# EAGLE design Project_design_v1.0 (EAGLE 8.4.0)
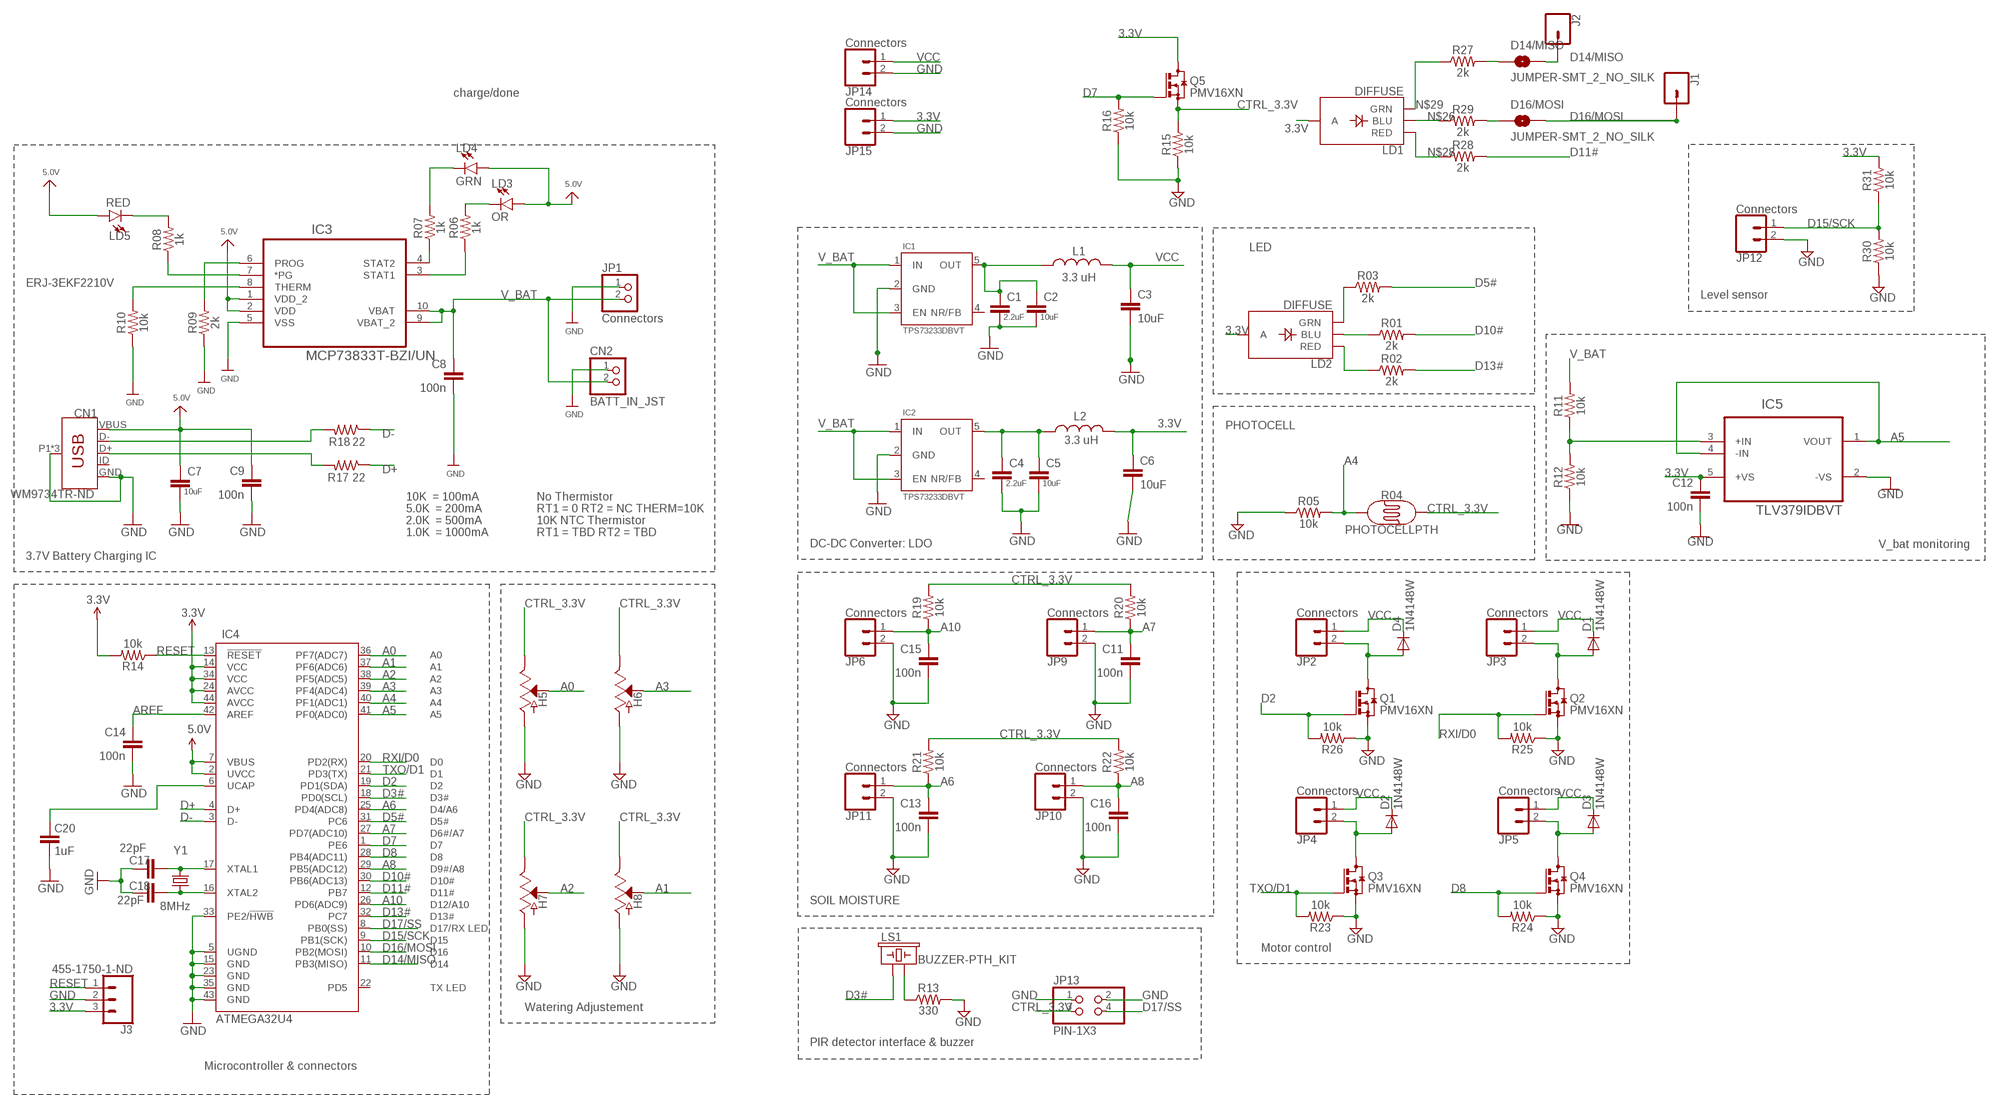
[diagram p0: schematic, sheet 1]

## Parts
C1  2.2uF  CAP0603-CAP  [0603-CAP]
C2  10uF  CAP0603-CAP  [0603-CAP]
C3  10uF  CAP0603-CAP  [0603-CAP]
C4  2.2uF  CAP0603-CAP  [0603-CAP]
C5  10uF  CAP0603-CAP  [0603-CAP]
C6  10uF  CAP0603-CAP  [0603-CAP]
C7  10uF  CAP0603-CAP  [0603-CAP]
C8  100n  CAPA0402  [0402]
C9  100n  CAPA0402  [0402]
C11  100n  CAPA0402  [0402]
C12  100n  CAPA0402  [0402]
C13  100n  CAPA0402  [0402]
C14  100n  CAPA0402  [0402]
C15  100n  CAPA0402  [0402]
C16  100n  CAPA0402  [0402]
C17  22pF  CAP0603-CAP  [0603-CAP]
C18  22pF  CAP0603-CAP  [0603-CAP]
C20  1uF  CAP0603-CAP  [0603-CAP]
CN1  WM9734TR-ND  USB_MICRO-B_FEMALE-SMT-VERT  [USB-B-MICRO-SMD_VERT]
CN2  BATT_IN_JST  JST_2PIN  [JSTPH2]
D1  1N4148W  CGRM4002-G  [SOD-123_MINI-SMA]
D2  1N4148W  CGRM4002-G  [SOD-123_MINI-SMA]
D3  1N4148W  CGRM4002-G  [SOD-123_MINI-SMA]
D4  1N4148W  CGRM4002-G  [SOD-123_MINI-SMA]
D14/MISO  JUMPER-SMT_2_NO_SILK  [SMT-JUMPER_2_NO_SILK]
D16/MOSI  JUMPER-SMT_2_NO_SILK  [SMT-JUMPER_2_NO_SILK]
H5  POT1  SOIL_MOISTURE  [SOIL_MOISTURE]
H6  POT2  SOIL_MOISTURE  [SOIL_MOISTURE]
H7  POT3  SOIL_MOISTURE  [SOIL_MOISTURE]
H8  POT4  SOIL_MOISTURE  [SOIL_MOISTURE]
IC1  TPS73233DBVT  TPS732XXDBV  [SOT23-5]
IC2  TPS73233DBVT  TPS732XXDBV  [SOT23-5]
IC3  MCP73833T-BZI/UN  [SOP50P490X110-10N]
IC4  ATMEGA32U4  ATMEGA32U4TQFP-44  [TQFP44]
IC5  TLV379IDBVT  AD8009JRTZ-REEL  [SOT95P280X145-5N]
J1  CONN_01  [1X01]
J2  CONN_01  [1X01]
J3  455-1750-1-ND  CONN_03  [1X03]
JP1  Connectors  PINHD-1X2  [1X02]
JP2  Connectors  CONN_02  [1X02]
JP3  Connectors  CONN_02  [1X02]
JP4  Connectors  CONN_02  [1X02]
JP5  Connectors  CONN_02  [1X02]
JP6  Connectors  CONN_02  [1X02]
JP9  Connectors  CONN_02  [1X02]
JP10  Connectors  CONN_02  [1X02]
JP11  Connectors  CONN_02  [1X02]
JP12  Connectors  CONN_02  [1X02]
JP13  PIN-1X3  PINHD-2X2  [2X02]
JP14  Connectors  CONN_02  [1X02]
JP15  Connectors  CONN_02  [1X02]
L1  3.3 uH  INDUCTOR0603  [0603]
L2  3.3 uH  INDUCTOR0603  [0603]
LD1  DIFFUSE  LED_RGB_THRU_CA  [LED-RGB_THRU_5MM]
LD2  DIFFUSE  LED_RGB_THRU_CA  [LED-RGB_THRU_5MM]
LD3  OR  LED3MM  [LED_3MM]
LD4  GRN  LED3MM  [LED_3MM]
LD5  RED  LED3MM  [LED_3MM]
LS1  BUZZER-PTH_KIT  [BUZZER-12MM-KIT]
Q1  PMV16XN  [SOT23]
Q2  PMV16XN  [SOT23]
Q3  PMV16XN  [SOT23]
Q4  PMV16XN  [SOT23]
Q5  PMV16XN  [SOT23]
R01  2k  0603RESIST  [0603]
R02  2k  0603RESIST  [0603]
R03  2k  0603RESIST  [0603]
R04  PHOTOCELLPTH  [PHOTOCELL]
R05  10k  0603RESIST  [0603]
R06  1k  0603RESIST  [0603]
R07  1k  0603RESIST  [0603]
R08  1k  0603RESIST  [0603]
R09  2k  0603RESIST  [0603]
R10  10k  0603RESIST  [0603]
R11  10k  0603RESIST  [0603]
R12  10k  0603RESIST  [0603]
R13  330  0603RESIST  [0603]
R14  10k  0603RESIST  [0603]
R15  10k  0603RESIST  [0603]
R16  10k  0603RESIST  [0603]
R17  22  RESISTOR0603-RES  [0603-RES]
R18  22  RESISTOR0603-RES  [0603-RES]
R19  10k  0603RESIST  [0603]
R20  10k  0603RESIST  [0603]
R21  10k  0603RESIST  [0603]
R22  10k  0603RESIST  [0603]
R23  10k  0603RESIST  [0603]
R24  10k  0603RESIST  [0603]
R25  10k  0603RESIST  [0603]
R26  10k  0603RESIST  [0603]
R27  2k  0603RESIST  [0603]
R28  2k  0603RESIST  [0603]
R29  2k  0603RESIST  [0603]
R30  10k  0603RESIST  [0603]
R31  10k  0603RESIST  [0603]
Y1  8MHz  CRYSTAL5X3  [CRYSTAL-SMD-5X3]

## Nets
3.3V: C6.1 C12.1 IC4.14(VCC) IC4.24(AVCC) IC4.34(VCC) IC4.44(AVCC) IC5.5(+VS) J3.3 JP15.1 L2.2 LD1.3(A) LD2.3(A) Q5.3(D) R14.2 R31.2
5.0V: C7.1 C9.1 CN1.VBUS IC3.1(VDD_2) IC3.2(VDD) IC4.2(UVCC) IC4.7(VBUS) LD3.A LD4.A LD5.A
A0: H5.3(VOUT) IC4.36(PF7(ADC7))
A1: H8.3(VOUT) IC4.37(PF6(ADC6))
A2: H7.3(VOUT) IC4.38(PF5(ADC5))
A3: H6.3(VOUT) IC4.39(PF4(ADC4))
A4: IC4.40(PF1(ADC1)) R04.1 R05.2
A5: IC4.41(PF0(ADC0)) IC5.1(VOUT) IC5.4(-IN)
A6: C13.1 IC4.25(PD4(ADC8)) JP11.1 R21.1
A7: C11.1 IC4.27(PD7(ADC10)) JP9.1 R20.1
A8: C16.1 IC4.29(PB5(ADC12)) JP10.1 R22.1
A10: C15.1 IC4.26(PD6(ADC9)) JP6.1 R19.1
AREF: C14.1 IC4.42(AREF)
CTRL_3.3V: H5.1(VCC) H6.1(VCC) H7.1(VCC) H8.1(VCC) JP13.3 Q5.2(S) R04.2 R15.2 R19.2 R20.2 R21.2 R22.2
D2: IC4.19(PD1(SDA)) Q1.1(G) R26.2
D3#: IC4.18(PD0(SCL)) LS1.+
D5#: IC4.31(PC6) R03.2
D7: IC4.1(PE6) Q5.1(G) R16.2
D8: IC4.28(PB4(ADC11)) Q4.1(G) R24.2
D10#: IC4.30(PB6(ADC13)) R01.2
D11#: IC4.12(PB7) R28.2
D13#: IC4.32(PC7) R02.2
D14/MISO: D14/MISO.2 IC4.11(PB3(MISO)) J2.1
D15/SCK: IC4.9(PB1(SCK)) JP12.1 R30.2 R31.1
D16/MOSI: D16/MOSI.2 IC4.10(PB2(MOSI)) J1.1
D17/SS: IC4.8(PB0(SS)) JP13.4
D+: IC4.4(D+) R17.1
D-: IC4.3(D-) R18.1
GND: C1.2 C2.2 C3.2 C4.2 C5.2 C6.2 C7.2 C8.2 C9.2 C11.2 C12.2 C13.2 C14.2 C15.2 C16.2 C17.2 C18.2 C20.1 CN1.GND CN1.P1(SHIELD) CN1.P2(SHIELD) CN1.P3(SHIELD) CN2.1 H5.2(GND) H6.2(GND) H7.2(GND) H8.2(GND) IC1.2(GND) IC2.2(GND) IC3.5(VSS) IC4.5(UGND) IC4.15(GND) IC4.23(GND) IC4.33(PE2/!HWB) IC4.35(GND) IC4.43(GND) IC5.2(-VS) J3.2 JP1.1 JP6.2 JP9.2 JP10.2 JP11.2 JP12.2 JP13.1 JP13.2 JP14.2 JP15.2 Q1.2(S) Q2.2(S) Q3.2(S) Q4.2(S) R05.1 R09.1 R10.1 R12.1 R13.2 R15.1 R16.1 R23.1 R24.1 R25.1 R26.1 R30.1
N$1: LD2.2(GRN) R03.1
N$2: C4.1 C5.1 IC2.5(OUT) L2.1
N$3: LD3.K(C) R06.2
N$4: LD4.K(C) R07.2
N$5: IC3.4(STAT2) R07.1
N$6: IC3.3(STAT1) R06.1
N$7: IC3.7(*PG) R08.1
N$8: IC3.8(THERM) R10.2
N$9: C18.1 IC4.16(XTAL2) Y1.1
N$10: D4.A JP2.2 Q1.3(D)
N$11: D1.A JP3.2 Q2.3(D)
N$12: LD5.K(C) R08.2
N$13: C1.1 C2.1 IC1.5(OUT) L1.1
N$14: D2.A JP4.2 Q3.3(D)
N$15: D3.A JP5.2 Q4.3(D)
N$16: IC3.6(PROG) R09.2
N$17: IC5.3(+IN) R11.1 R12.2
N$18: C17.1 IC4.17(XTAL1) Y1.3
N$19: C20.2 IC4.6(UCAP)
N$20: CN1.D- R18.2
N$21: CN1.D+ R17.2
N$22: LS1.- R13.1
N$26: LD1.1(BLU) R29.1
N$28: LD1.4(RED) R28.1
N$29: LD1.2(GRN) R27.1
N$30: D16/MOSI.1 R29.2
N$32: D14/MISO.1 R27.2
N$34: LD2.1(BLU) R01.1
N$35: LD2.4(RED) R02.1
RESET: IC4.13(!RESET) J3.1 R14.1
RXI/D0: IC4.20(PD2(RX)) Q2.1(G) R25.2
TXO/D1: IC4.21(PD3(TX)) Q3.1(G) R23.2
V_BAT: C8.1 CN2.2 IC1.1(IN) IC1.3(EN) IC2.1(IN) IC2.3(EN) IC3.9(VBAT_2) IC3.10(VBAT) JP1.2 R11.2
VCC: C3.1 D1.C D2.C D3.C D4.C JP2.1 JP3.1 JP4.1 JP5.1 JP14.1 L1.2
Unconnected: CN1.ID IC1.4(NR/FB) IC2.4(NR/FB) IC4.22(PD5)

## Notes on the sheet
- charge/done
- LED
- ERJ-3EKF2210V
- Level sensor
- PHOTOCELL
- 10K  = 100mA | No Thermistor
- 5.0K  = 200mA | RT1 = 0 RT2 = NC THERM=10K
- 2.0K  = 500mA | 10K NTC Thermistor
- 1.0K  = 1000mA | RT1 = TBD RT2 = TBD
- DC-DC Converter: LDO | V_bat monitoring
- 3.7V Battery Charging IC
- SOIL MOISTURE
- Motor control
- Watering Adjustement
- PIR detector interface & buzzer
- Microcontroller & connectors

## Library data of the parts
C1 C4 = SparkFun-Passives:CAP: Capacitor Standard 0603 ceramic capacitor, and 0.1" leaded capacitor.; PARTNO: C1608X7S1C225K080AC
C2 C3 C5-C7 = SparkFun-Passives:CAP: Capacitor Standard 0603 ceramic capacitor, and 0.1" leaded capacitor.; PARTNO: GRM188R60J106ME47D
C8 C9 C11-C16 = custom_part:CAPA; PARTNO: CGA2B3X7R1E104K050BB
C17 C18 = SparkFun:CAP: Capacitor Standard 0603 ceramic capacitor, and 0.1" leaded capacitor.; PARTNO: CL10C2R2BB8NNNC
C20 = SparkFun:CAP: Capacitor Standard 0603 ceramic capacitor, and 0.1" leaded capacitor.; PARTNO: CL10B105KP8NNNC
CN1 = SparkFun-Connectors:USB_MICRO-B: USB Type Micro-B Connector Male/female and PTH/SMT variants SparkFun Products: SparkFun microB USB Breakout <https://www.sparkfun.com/products/12035> SparkFun USB microB Plug Breakout <https://www.sparkfun.com/products/10031> SparkFun ESP8266 Thing <https://www.sparkfun.com/products/13231>; PARTNO: 1051330011; PROD_ID: CONN-13534
CN2 = microbuilder:JST_2PIN: JST 2-Pin Right-Angle Connector PH-Series - 4UConnector: 17311 SH-Series - 4UConnector: 07278; PARTNO: B2B-XH-A(LF)(SN)
D1-D4 = diode:CGRM400*-G: Molded plasitc,JEDEC SOD-123/Mini SMA Source: Comchip CGRM4001-G.pdf; PARTNO: 1N4148W
D14/MISO D16/MOSI = SparkFun-Jumpers:JUMPER-SMT_2_NO: Normally open jumper This jumper has two pads in close proximity to each other. Apply solder to close the connection. Round pads are easier to solder for beginners, but are a lot larger. SparkFun Product that uses the round pads: SparkFun EL Sequencer <https://www.sparkfun.com/products/12781>
H5-H8 = potentiometer:SOIL_MOISTURE; PARTNO: SEN-13322
IC1 IC2 = TPS32xx:TPS732XX: Cap-Free, NMOS, 250mA Low Dropout Regulator with Reverse Current Protection; PARTNO: TPS73233DBVT
IC3 = MCP73833T-BZI_UN:MCP73833T-BZI/UN: LI-ION/LI-POLY CONTROLLERS; AVAILABILITY: Good; DESCRIPTION: Linear Charge Management Controller Li-Ion/Li-Pol 1mA 4.2V/4.35V/4.4V/4.5V 10-Pin MSOP T/R; MF: Microchip; MP: MCP73833T-BZI/UN; PACKAGE: MSOP-10 Microchip; PRICE: 0.72 USD
IC4 = ATMEGA32U4:ATMEGA32U4: Atmel 44-pin 8-bit Microcontroller with 32KBytes of ISP Flash and USB Controller; AVAILABILITY: Good; DESCRIPTION: Embedded microcontroller ATMEGA32U4RC-AU TQFP 44 (10x10) Microchip Technology 8-Bit 16 MHz I/O number 26; MF: Microchip; MP: ATMEGA32U4RC-AU; PACKAGE: TQFP-44 Microchip; PARTNO: ATMEGA32U4RC-MUR; PRICE: 3.89 USD
IC5 = AD8009JRTZ-REEL:AD8009JRTZ-REEL: Low Distortion Amplifier; AVAILABILITY: Unavailable; DESCRIPTION: Ic Opamp Cfa 845mhz Sot23-5; MF: Analog Devices; MP: AD8009JRTZ-REEL; PACKAGE: SOT-23-5 Analog Devices; PARTNO: TLV379IDBVT; PRICE: 1.92 USD
J1 J2 = SparkFun-Connectors:CONN_01: Single connection point. Often used as Generic Header-pin footprint for 0.1 inch spaced/style header connections On any of the 0.1 inch spaced packages, you can populate with these: Break Away Headers - Straight <https://www.sparkfun.com/products/116> (PRT-00116) Break Away Male Headers - Right Angle <https://www.sparkfun.com/products/553> (PRT-00553) Female Headers <https://www.sparkfun.com/products/115> (PRT-00115) Break Away Headers - Machine Pin <https://www.sparkfun.com/products/117> (PRT-00117) Break Away Female Headers - Swiss Machine Pin <https://www.sparkfun.com/products/743> (PRT-00743) This device is also useful as a general connection point to wire up your design to another part of your project. Our various solder wires solder well into these plated through hole pads. Hook-Up Wire - Assortment (Stranded, 22 AWG) <https://www.sparkfun.com/products/11375> (PRT-11375) Hook-Up Wire - Assortment (Solid Core, 22 AWG) <https://www.sparkfun.com/products/11367> (PRT-11367) View the entire wire category on our website here <https://www.sparkfun.com/categories/141> Special notes: SMTSO-256-ET is a "flush mount" nut for a 4-40 screw. We mostly use this on specialty testbeds; it is a nice way to connect hardware to your PCB at an adjustable hieght. Also note, the SNAP packages are for using a snappable style connector. We sell a baggie of snaps and they are also used on two LilyPad designs: Snap Assortment - 30 pack (male and female) <https://www.sparkfun.com/products/11347> (DEV-11347) LilyPad Arduino SimpleSnap <https://www.sparkfun.com/products/10941> (DEV-10941) LilyPad SimpleSnap Protoboard <https://www.sparkfun.com/products/10940> (DEV-10940)
J3 = SparkFun-Connectors:CONN_03: Multi connection point. Often used as Generic Header-pin footprint for 0.1 inch spaced/style header connections On any of the 0.1 inch spaced packages, you can populate with these: Break Away Headers - Straight <https://www.sparkfun.com/products/116> (PRT-00116) Break Away Male Headers - Right Angle <https://www.sparkfun.com/products/553> (PRT-00553) Female Headers <https://www.sparkfun.com/products/115> (PRT-00115) Break Away Headers - Machine Pin <https://www.sparkfun.com/products/117> (PRT-00117) Break Away Female Headers - Swiss Machine Pin <https://www.sparkfun.com/products/743> (PRT-00743) Stackable Header - 3 Pin (Female, 0.1") <https://www.sparkfun.com/products/13875> (PRT-13875) For SCREWTERMINALS and SPRING TERMINALS visit here: Screw Terimnals on SparkFun.com <https://www.sparkfun.com/search/results?term=Screw+Terminals> (5mm/3.5mm/2.54mm spacing) This device is also useful as a general connection point to wire up your design to another part of your project. Our various solder wires solder well into these plated through hole pads. Hook-Up Wire - Assortment (Stranded, 22 AWG) <https://www.sparkfun.com/products/11375> (PRT-11375) Hook-Up Wire - Assortment (Solid Core, 22 AWG) <https://www.sparkfun.com/products/11367> (PRT-11367) View the entire wire category on our website here <https://www.sparkfun.com/categories/141> Special notes: Molex polarized connector foot print use with SKU : PRT-08232 with associated crimp pins and housings.; PROD_ID: XXX-00000
JP1 = pinhead:PINHD-1X2: PIN HEADER; PARTNO: /
JP2-JP6 JP9-JP12 JP14 JP15 = SparkFun-Connectors:CONN_02: Multi connection point. Often used as Generic Header-pin footprint for 0.1 inch spaced/style header connections On any of the 0.1 inch spaced packages, you can populate with these: Break Away Headers - Straight <https://www.sparkfun.com/products/116> (PRT-00116) Break Away Male Headers - Right Angle <https://www.sparkfun.com/products/553> (PRT-00553) Female Headers <https://www.sparkfun.com/products/115> (PRT-00115) Break Away Headers - Machine Pin <https://www.sparkfun.com/products/117> (PRT-00117) Break Away Female Headers - Swiss Machine Pin <https://www.sparkfun.com/products/743> (PRT-00743) For SCREWTERMINALS and SPRING TERMINALS visit here: Screw Terimnals on SparkFun.com <https://www.sparkfun.com/search/results?term=Screw+Terminals> (5mm/3.5mm/2.54mm spacing) This device is also useful as a general connection point to wire up your design to another part of your project. Our various solder wires solder well into these plated through hole pads. Hook-Up Wire - Assortment (Stranded, 22 AWG) <https://www.sparkfun.com/products/11375> (PRT-11375) Hook-Up Wire - Assortment (Solid Core, 22 AWG) <https://www.sparkfun.com/products/11367> (PRT-11367) View the entire wire category on our website here <https://www.sparkfun.com/categories/141> Special notes: Molex polarized connector foot print use with: PRT-08233 with associated crimp pins and housings. 2.54_SCREWTERM for use with PRT-10571. 3.5mm Screw Terminal footprints for PRT-08084 5mm Screw Terminal footprints for use with PRT-08432; PARTNO: M20-9960245
JP13 = pinhead:PINHD-2X2: PIN HEADER; PARTNO: M22-2040805
L1 L2 = SparkFun-Passives:INDUCTOR: Inductors Basic Inductor/Choke - 0603 and 1206. Footprints are not proven and vary greatly between part numbers. SRN6045- 33uH, 20% 1.4A; PARTNO: LQM18PN3R3MGHD
LD1 LD2 = RGB_LED:LED_RGB_THRU_CA; PARTNO: WP154A4SEJ3VBDZGW/CA
LD3 = SparkFun-LED:LED: LED (Generic) Standard schematic elements and footprints for 5mm, 3mm, 1206, and 0603 sized LEDs. Generic LEDs with no color specified.; PARTNO: TLHO4600; PROD_ID: DIO-08794
LD4 = SparkFun-LED:LED: LED (Generic) Standard schematic elements and footprints for 5mm, 3mm, 1206, and 0603 sized LEDs. Generic LEDs with no color specified.; PARTNO: TLLG4400; PROD_ID: DIO-08794
LD5 = SparkFun-LED:LED: LED (Generic) Standard schematic elements and footprints for 5mm, 3mm, 1206, and 0603 sized LEDs. Generic LEDs with no color specified.; PARTNO: TLHK4600; PROD_ID: DIO-08794
LS1 = SparkFun-Electromechanical:BUZZER: Buzzer Small round buzzers that operate around the audible 2kHz range. You can use these as speakers to create simple music or user interfaces. Variant Overview: PTH - Mini Speaker - PC Mount 12mm 2.048kHz <https://www.sparkfun.com/products/7950> PTH_KIT - Mini Speaker - PC Mount 12mm 2.048kHz <https://www.sparkfun.com/products/7950> KIT simplifies soldering by adding stop mask to one side of the pads. PTH_NO_SILK - Mini Speaker - PC Mount 12mm 2.048kHz <https://www.sparkfun.com/products/7950> No silkscreen indicator of buzzer outline. PTH_KIT_NO_SILK - Mini Speaker - PC Mount 12mm 2.048kHz <https://www.sparkfun.com/products/7950> KIT package w/o silkscreen SMD - Buzzer Audio Magnetic (CCV-084B16) SMD buzzer used on, e.g. the LilyPad Buzzer <https://www.sparkfun.com/products/8463> and RFID USB Reader <https://www.sparkfun.com/products/9963>. SMD_KIT - Buzzer Audio Magnetic (CCV-084B16) SMD Buzzer with elongated pins to make soldering easier. Used on the SparkFun Simon Says - Surface Mount Soldering Kit <https://www.sparkfun.com/products/10935>.; PARTNO: CEM-1203(42); PROD_ID: COMP-08253; SF_SKU: COM-07950
Q1-Q5 = custom_part_2:PMV16XN; PARTNO: PMV16XNR
R01-R03 R09 R27-R29 = custom_part:0603RESIST; PARTNO: ERJ-PA3F2001V
R04 = SparkFun-Sensors:PHOTOCELL: Photocell (Photodetector, Photo Resistor, CdS) This is a very small light sensor. A photocell changes (also called a photodetector, photo resistor, CdS or photoconductive cell) resistance depending on the amount of light it is exposed to. These little sensors make great ambient light triggers (when light in the room turns on, do something). Datasheet <http://cdn.sparkfun.com/datasheets/Sensors/LightImaging/SEN-09088.pdf> SparkFun Products Mini Photocell <https://www.sparkfun.com/products/9088> (SEN-09088); PARTNO: 1528-2141-ND; PROD_ID: COMP-09129; SF_ID: SEN-09088
R05 R10-R12 R14-R16 R19-R26 R30 R31 = custom_part:0603RESIST; PARTNO: ERA-3AEB103V
R06-R08 R13 = custom_part:0603RESIST; PARTNO: RC0603JR-07330RL
R17 R18 = SparkFun:RESISTOR: Resistor Basic schematic elements and footprints for 0603, 1206, and PTH resistors.; PARTNO: RC0603JR-0722RL
Y1 = SparkFun:CRYSTAL: Crystals Various standard crystals. Proven footprints. Spark Fun Electronics SKU : COM-00534; PARTNO: ABM3C-8.000MHZ-D4Y-T

## Net classes
7 GND: width 0.152 mm, clearance 0.2 mm

## Board
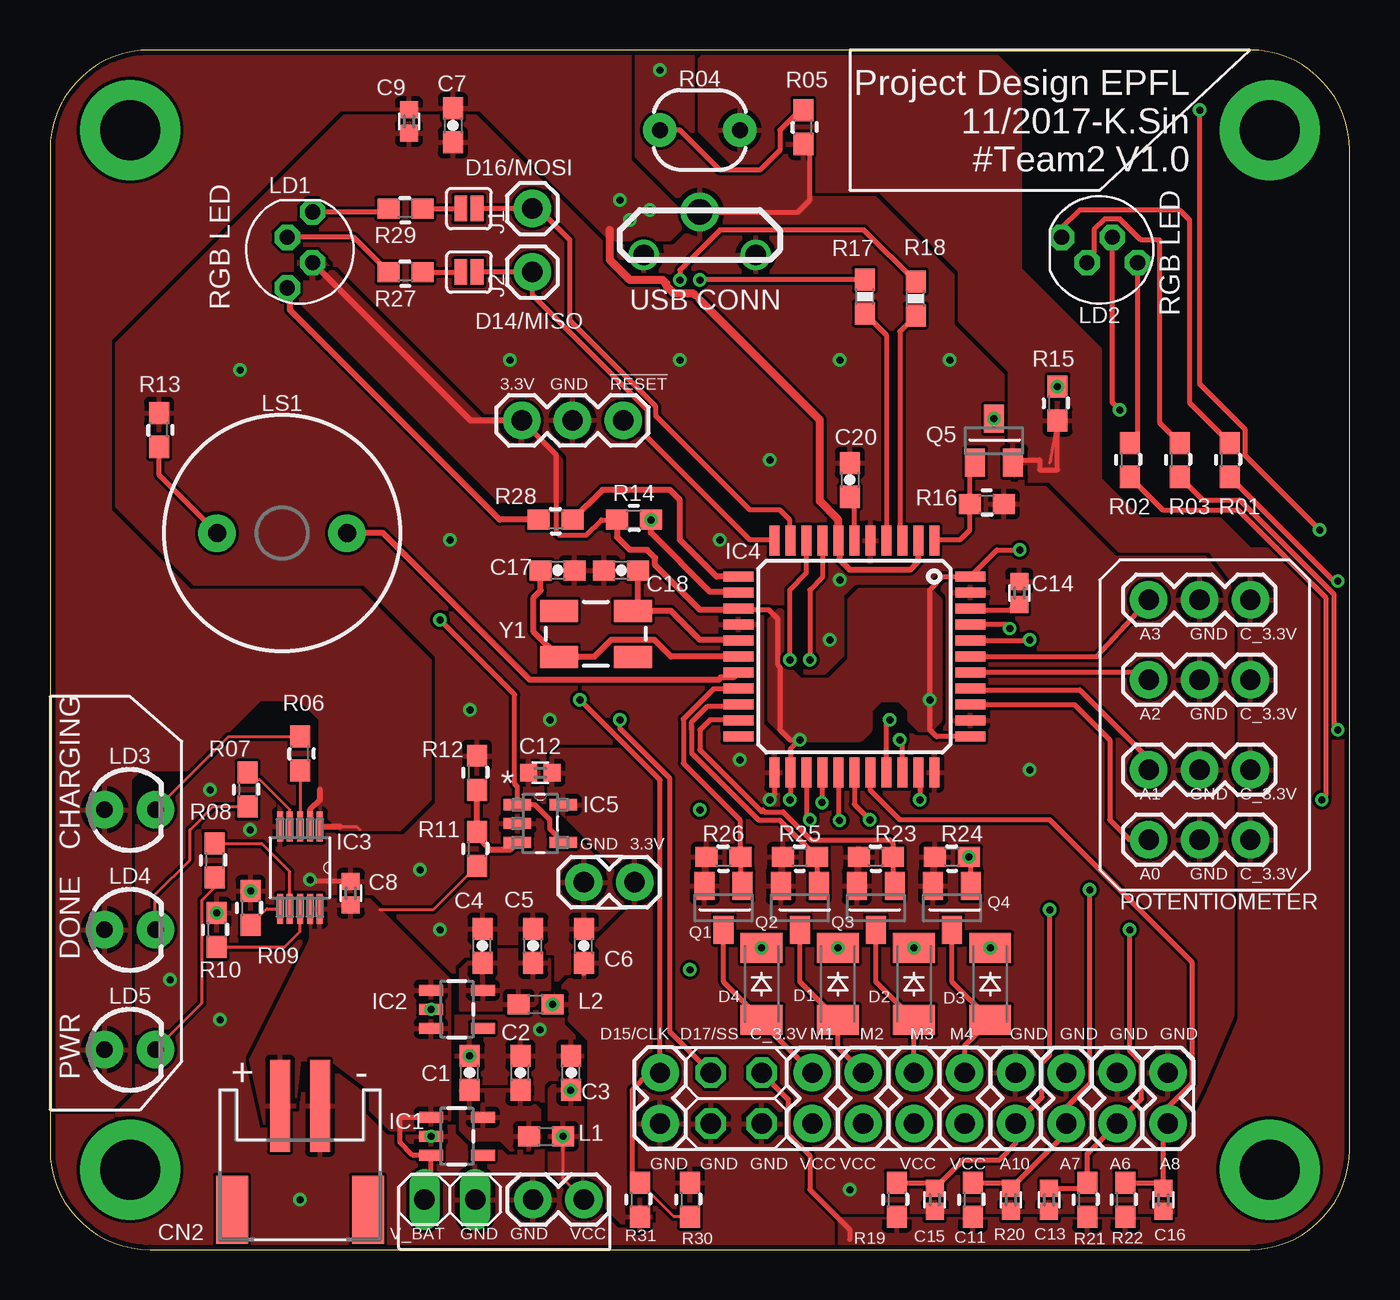
[diagram p1: board, top side]
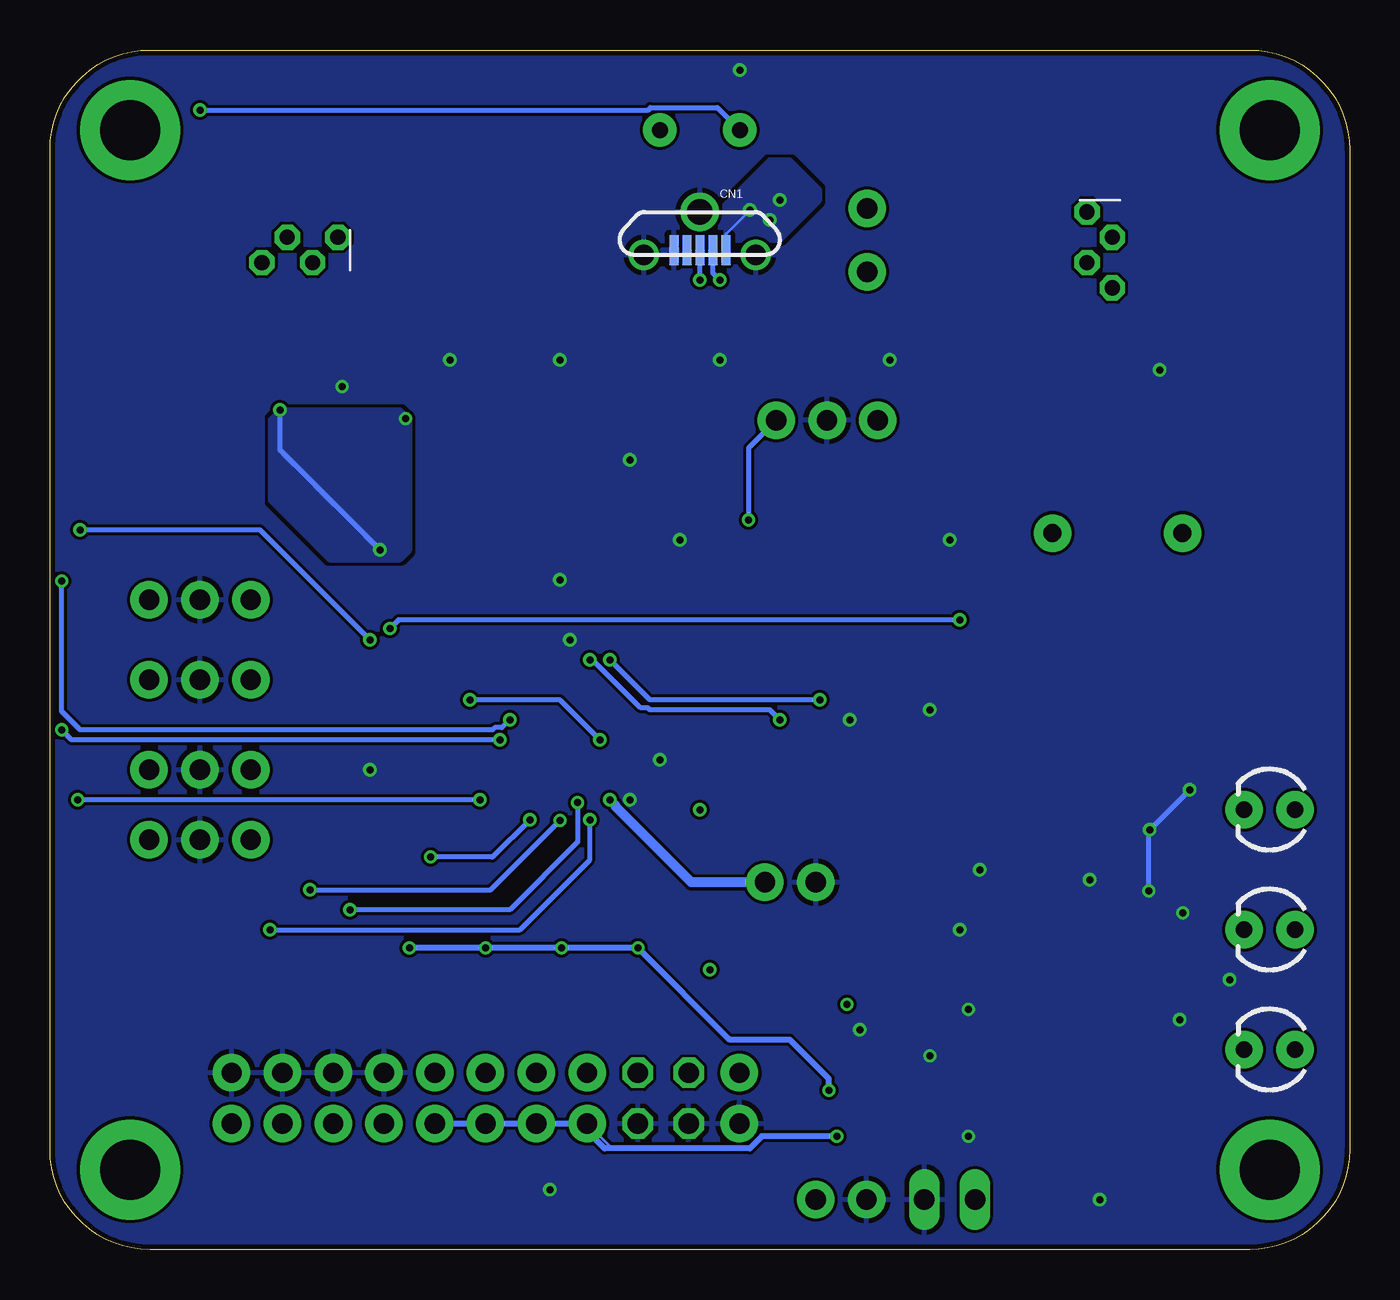
[diagram p2: board, bottom side, seen from below]

Size 65 x 60 mm. Coordinates in mm from the lower left corner, seen from the top.
Outline: 0,55 0,5 arc90 5,0 60,0 arc90 65,5 65,55 arc90 60,60 5,60 arc90 0,55
Copper layers (1*16): Top 0.035mm / dielectric 1.5mm / Bottom 0.035mm
Design rules "SeeedStudio_2layer_DRU_no_angle_20140221": minimum track width 6mil, minimum drill 12mil, track to track 6mil, track to pad 6mil, pad to pad 6mil, via to via 6mil, smd to smd 0mil, copper to edge 10mil, drill to drill 10mil, minimum pad ring 10mil, minimum via ring 6mil, stop-mask expansion 2mil, vias tented up to drill 100mil, thermal gap 10mil

### Footprints (pad centres in the part's own frame; a part is rotated, then mirrored left to right if it is on the bottom)
0603-CAP = smd 1.1 x 1: 1 -0.85,0; 2 0.85,0
0402 = smd 0.85 x 0.9: 1 -0.58,0; 2 0.58,0
USB-B-MICRO-SMD_VERT = smd 0.45 x 1.5: D+ 0,0; D- -0.65,0; GND 1.3,0; ID 0.65,0; VBUS -1.3,0 | drill 1.016: P1 -2.8,0.25; P2 2.8,0.25 | drill 1.27: P3 0,-1.9
JSTPH2 = smd 1 x 4.6: 1 -1,-3.7; 2 1,-3.7 | smd 1.6 x 3.4: NC1 -3.4,1.5; NC2 3.4,1.5
SOD-123_MINI-SMA = smd 1.5 x 2.1: A 1.8,0; C -1.8,0
SMT-JUMPER_2_NO_SILK = smd 0.635 x 1.27: 1 -0.406,0; 2 0.406,0
SOIL_MOISTURE = drill 1.016 pad 1.88: 1 -2.54,0; 2 0,0; 3 2.54,0
SOT23-5 = smd 0.55 x 1.2: 1 -0.95,-1.3; 2 0,-1.3; 3 0.95,-1.3; 4 0.95,1.3; 5 -0.95,1.3
SOP50P490X110-10N = smd 1.499 x 0.305: 1 -2.057,0.991; 2 -2.057,0.508; 3 -2.057,0; 4 -2.057,-0.508; 5 -2.057,-0.991; 6 2.057,-0.991; 7 2.057,-0.508; 8 2.057,0; 9 2.057,0.508; 10 2.057,0.991
TQFP44 = smd 1.5 x 0.5: 1 -5.8,4; 2 -5.8,3.2; 3 -5.8,2.4; 4 -5.8,1.6; 5 -5.8,0.8; 6 -5.8,0; 7 -5.8,-0.8; 8 -5.8,-1.6; 9 -5.8,-2.4; 10 -5.8,-3.2; 11 -5.8,-4; 23 5.8,-4; 24 5.8,-3.2; 25 5.8,-2.4; 26 5.8,-1.6; 27 5.8,-0.8; 28 5.8,0; 29 5.8,0.8; 30 5.8,1.6; 31 5.8,2.4; 32 5.8,3.2; 33 5.8,4 | smd 0.5 x 1.5: 12 -4,-5.8; 13 -3.2,-5.8; 14 -2.4,-5.8; 15 -1.6,-5.8; 16 -0.8,-5.8; 17 0,-5.8; 18 0.8,-5.8; 19 1.6,-5.8; 20 2.4,-5.8; 21 3.2,-5.8; 22 4,-5.8; 34 4,5.8; 35 3.2,5.8; 36 2.4,5.8; 37 1.6,5.8; 38 0.8,5.8; 39 0,5.8; 40 -0.8,5.8; 41 -1.6,5.8; 42 -2.4,5.8; 43 -3.2,5.8; 44 -4,5.8
SOT95P280X145-5N = smd 1.372 x 0.559: 1 -1.143,0.94; 2 -1.143,0; 3 -1.143,-0.94; 4 1.143,-0.94; 5 1.143,0.94
1X01 = drill 1.016 pad 1.88: 1 0,0
1X03 = drill 1.016 pad 1.88: 1 0,0; 2 2.54,0; 3 5.08,0
1X02 = drill 1.016 long: 1 -1.27,0; 2 1.27,0
1X02' = drill 1.016 pad 1.88: 1 0,0; 2 2.54,0
2X02 = drill 1.016 octagon: 1 -1.27,-1.27; 2 -1.27,1.27; 3 1.27,-1.27; 4 1.27,1.27
0603 = smd 1.1 x 1: 1 -0.85,0; 2 0.85,0
LED-RGB_THRU_5MM = drill 0.762 pad 1.27 octagon: 1 1.905,-0.635; 2 0.635,0.635; 4 -1.905,0.635 | drill 0.75 pad 1.27 octagon: 3 -0.635,-0.635
LED_3MM = drill 0.813 pad 1.88: A -1.27,0; K 1.27,0
BUZZER-12MM-KIT = drill 0.9 pad 1.88: + 3.25,0; - -3.25,0
SOT23 = smd 1 x 1.4: 1 -0.95,-1.1; 2 0.95,-1.1; 3 0,1.1
PHOTOCELL = drill 0.8 pad 1.676: 1 -2,0; 2 2,0
0603-RES = smd 1.1 x 1: 1 -0.85,0; 2 0.85,0
CRYSTAL-SMD-5X3 = smd 1.9 x 1.1: 1 -1.85,-1.15; 2 1.85,-1.15; 3 1.85,1.15; 4 -1.85,1.15

### Placement (x,y rotation side)
C1  20.99,8.84 90 top
C2  23.53,8.84 90 top
C3  26.07,8.84 90 top
C4  21.62,15.19 90 top
C5  24.16,15.19 90 top
C6  26.7,15.19 90 top
C7  20.16,56.23 270 top
C8  15.04,17.82 90 top
C9  17.96,56.43 270 top
C11  48.06,2.49 270 top
C12  24.52,23.85 180 top
C13  49.97,2.49 270 top
C14  48.48,32.84 90 top
C15  44.26,2.49 270 top
C16  55.69,2.49 270 top
C17  25.39,33.97 0 top
C18  28.57,33.97 180 top
C20  40,38.5 270 top
CN1  32.5,50 180 bottom
CN2  12.5,3.5 180 top
D1  39.41,13.29 270 top
D2  43.22,13.29 270 top
D3  47.02,13.29 270 top
D4  35.59,13.29 270 top
D14/MISO  20.95,48.9 0 top
D16/MOSI  20.95,52.07 0 top
H5  57.5,20.5 180 top
H6  57.5,32.5 180 top
H7  57.5,28.5 180 top
H8  57.5,24 180 top
IC1  20.36,5.67 270 top
IC2  20.36,12.02 270 top
IC3  12.51,19.09 270 top
IC4  40.23,29.66 270 top
IC5  24.52,21.31 0 top
J1  24.13,52.07 90 top
J2  24.13,48.9 90 top
J3  28.68,41.48 180 top
JP1  20,2.5 180 top
JP2  Connectors  [1X02']  38.13,6.3 90 top
JP3  Connectors  [1X02']  40.67,6.3 90 top
JP4  Connectors  [1X02']  43.22,6.3 90 top
JP5  Connectors  [1X02']  45.76,6.3 90 top
JP6  Connectors  [1X02']  48.3,6.3 90 top
JP9  Connectors  [1X02']  50.84,6.3 90 top
JP10  Connectors  [1X02']  55.91,6.3 90 top
JP11  Connectors  [1X02']  53.38,6.3 90 top
JP12  Connectors  [1X02']  30.52,8.84 270 top
JP13  34.33,7.57 90 top
JP14  Connectors  [1X02']  26.7,2.5 180 top
JP15  Connectors  [1X02']  29.24,18.38 180 top
L1  24.8,5.67 0 top
L2  24.29,12.27 0 top
LD1  12.5,50 90 top
LD2  52.5,50 180 top
LD3  4,22 0 top
LD4  4,16 0 top
LD5  4,10 0 top
LS1  11.61,35.84 0 top
Q1  33.69,17.09 180 top
Q2  37.5,17.09 180 top
Q3  41.31,17.09 180 top
Q4  45.12,17.09 180 top
Q5  47.22,40.45 0 top
R01  59,39.5 270 top
R02  54,39.5 270 top
R03  56.5,39.5 270 top
R04  32.5,56 0 top
R05  37.67,56.15 90 top
R06  12.51,24.81 90 top
R07  9.88,23 270 top
R08  8.23,19.46 270 top
R09  10.04,17.09 270 top
R10  8.33,15.98 270 top
R11  21.35,20.04 270 top
R12  21.35,23.85 270 top
R13  5.45,41 90 top
R14  29.2,36.51 180 top
R15  50.39,42.32 270 top
R16  46.85,37.28 180 top
R17  40.76,47.66 90 top
R18  43.3,47.56 90 top
R19  42.35,2.49 270 top
R20  46.16,2.49 270 top
R21  51.88,2.49 270 top
R22  53.78,2.49 270 top
R23  41.31,19.64 0 top
R24  45.12,19.64 0 top
R25  37.5,19.64 0 top
R26  33.69,19.64 0 top
R27  17.78,48.9 0 top
R28  25.3,36.51 0 top
R29  17.78,52.07 0 top
R30  32,2.5 270 top
R31  29.5,2.5 270 top
Y1  27.3,30.8 180 top

### Tracks (layer width: path | path; a pad name or v marks a point on that pad's centre or on a via)
3.3V  (via drill 0.35)
  Top 0.254: J3.3 25.32,39.76 25.32,35.89 25.48,35.73 26.81,35.73 27.58,36.5 R14.2 | v53.5,42 53.13,42.37 LD2.3 | v48.5,35 47.37,35 IC4.44 44.66,33.66 44,33 v44,27.5 44,26 44.34,25.66 IC4.34 | v37,22.5 37.03,22.53 IC4.24 37.03,25.03 v37.5,25.5 37,25.5 36.5,26 36.5,29.14 36.39,29.25 36.39,31.55 35.94,32 34.49,32 IC4.14
  Top 0.305: 26.7,13.83 C6.1 | IC4.14 34.37,32 32.5,32 30.27,34.23 30.27,34.6 29.87,35 29,35 28.36,35.65 R14.2 | LD1.3 21.02,41.48 J3.3
  Bottom 0.254: v37.5,25.5 39.5,27.5 v44,27.5 | v48.5,35 53.5,40 v53.5,42
  Bottom 0.508: v37,22.5 36.73,22.23 36.73,22.2 32.91,18.38 JP15.1
  other vias: 25.14,12.27 47.22,41.55
  pour Top (rank 2): 29,2.5 30,2.5 30,1 29,1 27,3 27,10 27,10.5 25.5,12 25,12 25,12.5 26.5,14 26.5,14.5 29,17 29,18 28.5,18.5 28.5,19 27,20.5 26.5,21 25.5,22 25,22.5 25,24.5 25.5,25 28.5,25 30,23.5 30,10
  pour Bottom: 47,41.5 47.5,42 53.5,42 54,41.5 54,37.5 51,34.5 47.5,34.5 47,35
  pour Top: 37.5,25.5 37,25.5 36,26.5 36,31.5 36.5,32 37,31.5 37,29 37.5,28.5 38,28.5 39,28.5 40,29.5 40,32.5 40.5,33 43.5,33 44,33 44.5,32.5 44.5,27.5 44.5,26.5 44,26 43.5,26 43,26.5 43,27 42.5,27.5 41.5,27.5 41,27 41,26.5 41,26 40.5,25.5
  pour Top (rank 2): 25.5,37.5 22.5,37.5 12.5,47.5 12.5,49.5 13.5,49.5 21.5,41.5 22,41.5 23.5,41.5 25.5,39.5
5.0V  (via drill 0.35)
  Top 0.152: 14.5,21.15 15.35,21.15 15.5,21 | 13.5,22.5 13.01,22.01 | v30,52 29.5,52 v29,51.5
  Top 0.254: 43.43,35 IC4.2 | 39.5,35 39.5,35.39 IC4.7
  Top 0.305: 43.43,35 43.43,34.43 43,34 40,34 39.5,34.5 39.5,35 | 32.5,47.5 32.25,47.75 | IC3.1 14.5,21.15 | IC3.2 13.01,22.01 13.5,22.5 13.5,23
  Top 0.406: IC4.7 39.43,36.5 38.5,37.43 38.5,41.5 32.5,47.5 | 32.25,47.75 32.18,47.82 31.22,47.82 30.82,48.22 30.82,48.32 30.64,48.5 29,48.5 28,49.5 28,51
  Bottom 0.152: CN1.VBUS 31.2,50.8 v30,52
  other vias: 28.5,52.5
  pour Top: 4,23.5 4,8 3,7 0.5,7 -0.5,8 -0.5,60 0.5,61 22.5,61 27.5,61.5 29,61.5 29,54.5 31.5,52 31.5,51 31,50.5 28,50.5 21.5,57 14.5,57 3,45.5 3,37 7,33 15.5,33 19,29.5 19,22.5 17.5,21 14.5,21 13.5,22 13.5,26.5 12.5,27.5 10.5,27.5 7,24 4.5,24
  pour Bottom: 31,50.5 28.5,50.5 26.5,52.5 26.5,53 28,54.5 29,54.5 31.5,52 31.5,51
A0
  Top 0.254: IC4.36 51.24,27.26 53,25.5 53,21.5 54,20.5 H5.3
A1
  Top 0.254: IC4.37 46.09,28 51.5,28 54.96,24.54 H8.3
A2
  Top 0.254: H7.3 54.63,28.86 IC4.38
A3
  Top 0.254: IC4.39 52.37,29.66 H6.3
A4  (via drill 0.35)
  Top 0.254: IC4.40 48.96,30.46 v49,30.5 | v63.5,36 59.78,39.72 59.78,41.02 57.5,43.3 v57.5,57 | R05.2 37.5,57 36.5,56 36.5,55 35.5,54 33.5,54 31.5,56 R04.1
  Bottom 0.254: v49,30.5 54.5,36 v63.5,36 | v57.5,57 35.08,57 34.96,57.12 31.62,57.12 R04.1
A5  (via drill 0.35)
  Top 0.254: v19.5,31.5 23.24,27.76 23.24,23.28 23.38,23.14 IC5.1 24.25,22.25 25,21.5 25,21.04 IC5.4 | v48,31.07 47.81,31.26 IC4.41
  Bottom 0.254: v19.5,31.5 47.57,31.5 v48,31.07
A6  (via drill 0.35)
  Top 0.254: C13.1 51.6,3.07 R21.1 51.88,4.8 JP11.1 54.59,7.52 54.59,9.35 54,9.94 v54,16 | IC4.25 37.83,21.67 v38,21.5
  Bottom 0.254: v54,16 41.5,16 38,19.5 v38,21.5
A7  (via drill 0.35)
  Top 0.254: R20.1 47.8,3.34 C11.1 50.84,5.84 JP9.1 50.84,7.12 52.05,8.34 52.05,9.35 52,9.4 v52,18 | IC4.27 39.43,21.53 v39.5,21.46
  Bottom 0.254: v52,18 42.96,18 v39.5,21.46
A8
  Top 0.254: R22.1 55.66,3.34 56,3 55.76,3 C16.1 55.69,6.07 JP10.1 55.91,7.12 57.13,8.34 57.13,14.37 50,21.5 42.5,21.5 41.03,22.97 IC4.29
A10  (via drill 0.35)
  Top 0.254: R19.1 43.98,3.34 C15.1 45.69,4.5 47.5,4.5 48.3,5.29 JP6.1 49.62,7.62 49.62,9.35 50,9.73 v50,17 | IC4.26 38.61,23.84 v38.61,22.35
  Bottom 0.254: v38.61,22.35 38.61,21 | 38.61,21 38.61,20.89 | 38.61,21 38.61,20.39 42,17 v50,17
AREF
  Top 0.254: IC4.42 46.09,32 48,32 48.26,32.26 C14.1
CTRL_3.3V
  Top 0.152: R15.2 50.01,39.35
  Top 0.254: JP13.3 36.92,7.52 36.92,5.79 38,4.71 38,3 40,1 40,0.5 | Q5.2 48.16,39.5 49.5,39.5 49.5,39 50.39,39 R15.2
  pour Top: 39.5,1.5 39.5,-1.5 40,-2 64,-2 68,2 68,33 67,34 62.5,34 61.5,35 60,35 58.5,36.5 54.5,36.5 52.5,38.5 52.5,45 48.5,49 48.5,58.5 45.5,61.5 34.5,61.5 32.5,59.5 32.5,56 34.5,54 36,54 37,53 41.5,53 45.5,49 45.5,46.5 48,44 48,39 48.5,38.5 50,38.5 53.5,35 58,35 59.5,33 59.5,11.5 58,8 56.5,5 56.5,1.5
D2
  Top 0.254: Q1.1 34.54,18.3 R26.2 34.5,19.68 34.5,21.5 31.69,24.31 31.69,26.5 | 31.69,26.55 31.69,26.5 | 31.69,26.5 31.69,26.55 | 31.69,26.55 33.2,28.06 IC4.19
D3#
  Top 0.305: IC4.18 34.19,28.61 33.55,28.61 33.44,28.5 24,28.5 16.66,35.84 LS1.+
D5#  (via drill 0.35)
  Top 0.254: R03.2 57.65,37.5 59.5,37.5 64.21,32.79 64.21,26.2 v64.41,26 | IC4.31 42.63,25.37 v42.5,25.5
  Bottom 0.254: v42.5,25.5 63.91,25.5 v64.41,26
D7
  Top 0.254: IC4.1 44.27,35.5 45.5,35.5 46,36 R16.2 46,39.09 Q5.1
D8  (via drill 0.35)
  Top 0.254: IC4.28 40.23,22.27 v41,21.5 | R24.2 46.05,19.55 46.05,18.21 Q4.1
  Bottom 0.254: v41,21.5 42.87,19.64 R24.2
  other vias: 45.97,19.64
D10#  (via drill 0.35)
  Top 0.254: IC4.30 41.83,26.33 v42,26.5 | R01.2 64.21,33.44 v64.42,33.44
  Bottom 0.254: v42,26.5 42.39,26.11 42.75,26.11 42.86,26 63.5,26 64.42,26.92 v64.42,33.44
D11#
  Top 0.305: IC4.12 33.34,33.66 33,34 31.5,35.5 31.5,37.5 31,38 27.64,38 R28.2
D13#  (via drill 0.35)
  Top 0.254: R02.2 55.65,37 59.42,37 63.81,32.62 63.81,22.7 v63.61,22.5 | IC4.32 43.5,23.79 v43.5,22.5
  Bottom 0.254: v43.5,22.5 v63.61,22.5
D14/MISO
  Top 0.254: D14/MISO.2 J2.1 24.13,47.75 29.89,41.98 29.89,40.61 35,35.5 36.19,35.5 IC4.11
D15/SCK  (via drill 0.35)
  Top 0.152: R30.2 31.2,1.65 R31.1
  Top 0.254: R31.1 29.13,3.72 29.13,8 29.97,8.84 JP12.1 30.52,23.48 v26.5,27.5 | v37,29.5 37,33 37.83,33.83 IC4.9
  Bottom 0.254: v26.5,27.5 35,27.5 v37,29.5
D16/MOSI
  Top 0.254: D16/MOSI.2 J1.1 24.43,52.07 26,50.5 26,46.45 30.3,42.15 30.3,41.7 35,37 36.5,37 37,36.5 37,35.49 IC4.10
D17/SS  (via drill 0.35)
  Top 0.254: JP13.4 31,10.89 31,23.57 28.5,26.07 v28.5,26.5 | v38,29.5 38,33 38.63,33.63 IC4.8
  Bottom 0.254: v28.5,26.5 29,27 35,27 35.09,27.09 35.45,27.09 37.86,29.5 v38,29.5
D+
  Top 0.254: R17.1 41.83,45.74 IC4.4
D-
  Top 0.254: R18.1 42.5,45.91 42.5,35.59 IC4.3
GND  (via drill 0.35)
  Top 0.254: CN1.P3 37.4,51.9 38,52.5 38,54.98 R05.1 | IC4.23 36.23,22.73 v36,22.5 | C8.2 13.1,18.41 v13,18.5
  Bottom 0.254: v10.04,17.93 10.04,20.96 v10,21 v8,23
  other vias: 50.39,43.17 19.05,12.02 20.99,9.69 19.05,5.67 8.33,16.84 23,44.5 31.5,44.5 39.5,44.5 45,44.5 9.5,44 6,13.5 8.5,11.5 40,3 49,24 12.5,2.5 20,35.5 21,27 19.5,16 39,30.5 36,39.5 30.5,59 24.5,11 33.5,35.5 39.5,33.5 34.5,24.5 18.5,19 25,26.5
  pour Top (rank 6): -6,-4 -6,64 71,64 71,-4
  pour Bottom (rank 6): -5,-4.5 -5,64 70.5,64 71,-5.5 -4.5,-5.5
N$1
  Top 0.254: R03.1 55.5,41.35 55.5,50.5 54.56,50.5 53.51,51.55 52.76,51.55 52.22,51.01 52.22,49.72 LD2.2
N$2
  pour Top: 20.5,12 24,12 25,13 25,14.5 24.5,15 21.5,15 20.5,14
N$3
  Top 0.152: LD3.K 8.93,25.66 R06.2
N$4
  Top 0.152: LD4.K 5.27,17.77 7,19.5 7,21 8.15,22.16 R07.2
N$5
  Top 0.152: IC3.4 12,22 10.5,23.5 10,23.5 9.88,23.62 R07.1
N$6
  Top 0.152: R06.1 IC3.3
N$7
  Top 0.152: IC3.7 12,18.9 10.6,20.3 R08.1
N$8
  Top 0.152: R10.2 11.73,15.13 12.51,15.9 IC3.8
N$9
  Top 0.305: IC4.16 34.39,30.5 32.5,30.5 31.05,31.95 Y1.1 29.42,32.22 C18.1
N$10
  Top 0.254: JP2.2 35.59,11.38 D4.A 33.69,13.39 Q1.3
N$11
  Top 0.254: JP3.2 39.41,10.11 D1.A 37.5,13.39 Q2.3
N$12
  Top 0.152: R08.2 8.23,18.11 7.6,17.48 7.6,12.33 LD5.K
N$13
  pour Top: 20.5,8 20.5,6 21,5.5 22.5,5.5 23,5 24,5 24.5,5.5 24.5,7 24,7.5 24,8
N$14
  Top 0.254: JP4.2 D2.A 41.31,13.39 Q3.3
N$15
  Top 0.254: JP5.2 45.76,10.21 D3.A 45.12,13.39 Q4.3
N$16
  Top 0.152: R09.2 10.84,17.04 IC3.6
N$17
  Top 0.305: IC5.3 23.01,20 22.02,20 21.35,20.67 R11.1 R12.2
N$18
  Top 0.305: IC4.17 31.07,29.66 30.23,30.5 28.07,30.5 27.22,29.64 Y1.3 24.2,30.9 24.2,32.62 24.55,32.97 C17.1
N$19
  Top 0.254: IC4.6 40.23,37.92 C20.2
N$20  (via drill 0.35)
  Top 0.254: R18.2 40.72,51 33.5,51 31.5,49 v31.5,48.5
  Bottom 0.254: v31.5,48.5 31.85,48.85 CN1.D-
N$21  (via drill 0.35)
  Top 0.254: R17.2 32.52,48.52 v32.5,48.5
  Bottom 0.254: v32.5,48.5 CN1.D+
N$22
  Top 0.254: LS1.- 5.45,38.74 R13.1
N$23  (via drill 3 pad 5)
  other vias: 4,56
N$24  (via drill 3 pad 5)
  other vias: 61,56
N$25  (via drill 3 pad 5)
  other vias: 61,4
N$26
  Top 0.254: LD1.1 16.77,51.91 R29.1
N$27  (via drill 3 pad 5)
  other vias: 4,4
N$28
  Top 0.305: R28.1 22.49,36.51 12,47 12,47.96 LD1.4
N$29
  Top 0.254: R27.1 15.19,50.63 LD1.2
N$30
  Top 0.254: R29.2 D16/MOSI.1
N$32
  Top 0.254: R27.2 D14/MISO.1
N$34
  Top 0.254: R01.1 57,42.35 57,51.5 56.5,52 51.5,52 50.59,51.09 LD2.1
N$35
  Top 0.254: R02.1 54.41,40.76 LD2.4
N$36  (via drill 0.35)
  other vias: 32,14
N$37  (via drill 0.35)
  other vias: 32.5,22
RESET  (via drill 0.35)
  Top 0.305: IC4.13 34.4,32.89 33.02,32.89 30.05,35.86 v30.05,36.5 R14.1
  Bottom 0.254: J3.1 30.05,40.1 v30.05,36.5
RXI/D0
  Top 0.254: Q2.1 38.35,18.3 R25.2 36.5,21.49 35.44,21.49 32.09,24.83 32.09,26 | 32.09,26.17 32.09,26 | 32.09,26 32.09,26.38 32.89,27.18 34.35,27.18 IC4.20
TXO/D1
  Top 0.254: Q3.1 42.16,18.3 42.16,19.5 | 42.16,19.5 R23.2 | IC4.21 34.39,26.5 33,26.5 32.5,26 32.5,25 35.5,22 | 35.5,22 35.61,21.89 | 35.5,22 35.64,22 35.75,21.89 36.67,21.89 38.06,20.5 42,20.5 42.16,20.34 42.16,19.5
V_BAT
  Top 0.152: R11.2 19.16,17 16.5,17
  Top 0.254: JP1.2 19.05,2.5 IC1.3 18.14,4.71 17.5,5.36 17.5,6.5 17.61,6.62 IC1.1
  pour Top: 12,5 12.5,9.5 14,9.5 16,8 16,7 17,6 19.5,6 20,6.5 20,13.5 16,17.5 13,17.5 13,15.5 10,9.5 11,5
VCC  (via drill 0.35)
  Top 0.152: JP14.1 25.65,3.55 L1.2 | C3.1 v26.04,7.96 25.65,7.57
  Bottom 0.152: L1.2 29.5,5.67 30.03,5.13 36.97,5.13 JP2.1 38.5,6.3 JP3.1 41,6.3 JP4.1 43.5,6.3 45.5,6.3 JP5.1
  Bottom 0.254: 43.13,15 D2.C
  Bottom 0.305: L1.2 29.39,5.67 30,5.05 37.26,5.05 38.5,6.3 | JP2.1 41,6.3 | JP3.1 43.5,6.3 | JP4.1 45.5,6.3 | v26.04,7.96 26.04,8.54 28,10.5 31.01,10.5 D4.C D1.C 43.05,15.09 43.13,15 | D2.C D3.C
  other vias: 25.65,5.67 35.59,15.09 39.41,15.09 43.22,15.09 47.02,15.09
  pour Top (rank 3): 27,2.5 27,8 26.5,8.5 26,8.5 25.5,8.5 25,8 25,4 26,3 26,2.5

### Text on the board
tPlace: Project Design EPFL / 11/2017-K.Sin / #Team2 V1.0 | RGB LED | RGB LED | USB CONN | 3.3V | GND | !RESET | A3 | GND | C_3.3V | A2 | GND | C_3.3V | A1 | GND | C_3.3V | CHARGING | GND | 3.3V | A0 | GND | C_3.3V | POTENTIOMETER | DONE | D15/CLK | D17/SS | C_3.3V | M1 | M2 | M3 | M4 | GND | GND | GND | GND | PWR | GND | GND | GND | VCC | VCC | VCC | VCC | A10 | A7 | A6 | A8 | V_BAT | GND | GND | VCC
Mechanical: LED RGB 5mm diam / LED R/G/O 3mm diam